# Altium schematic sheet Fan Control.SchDoc
size A3
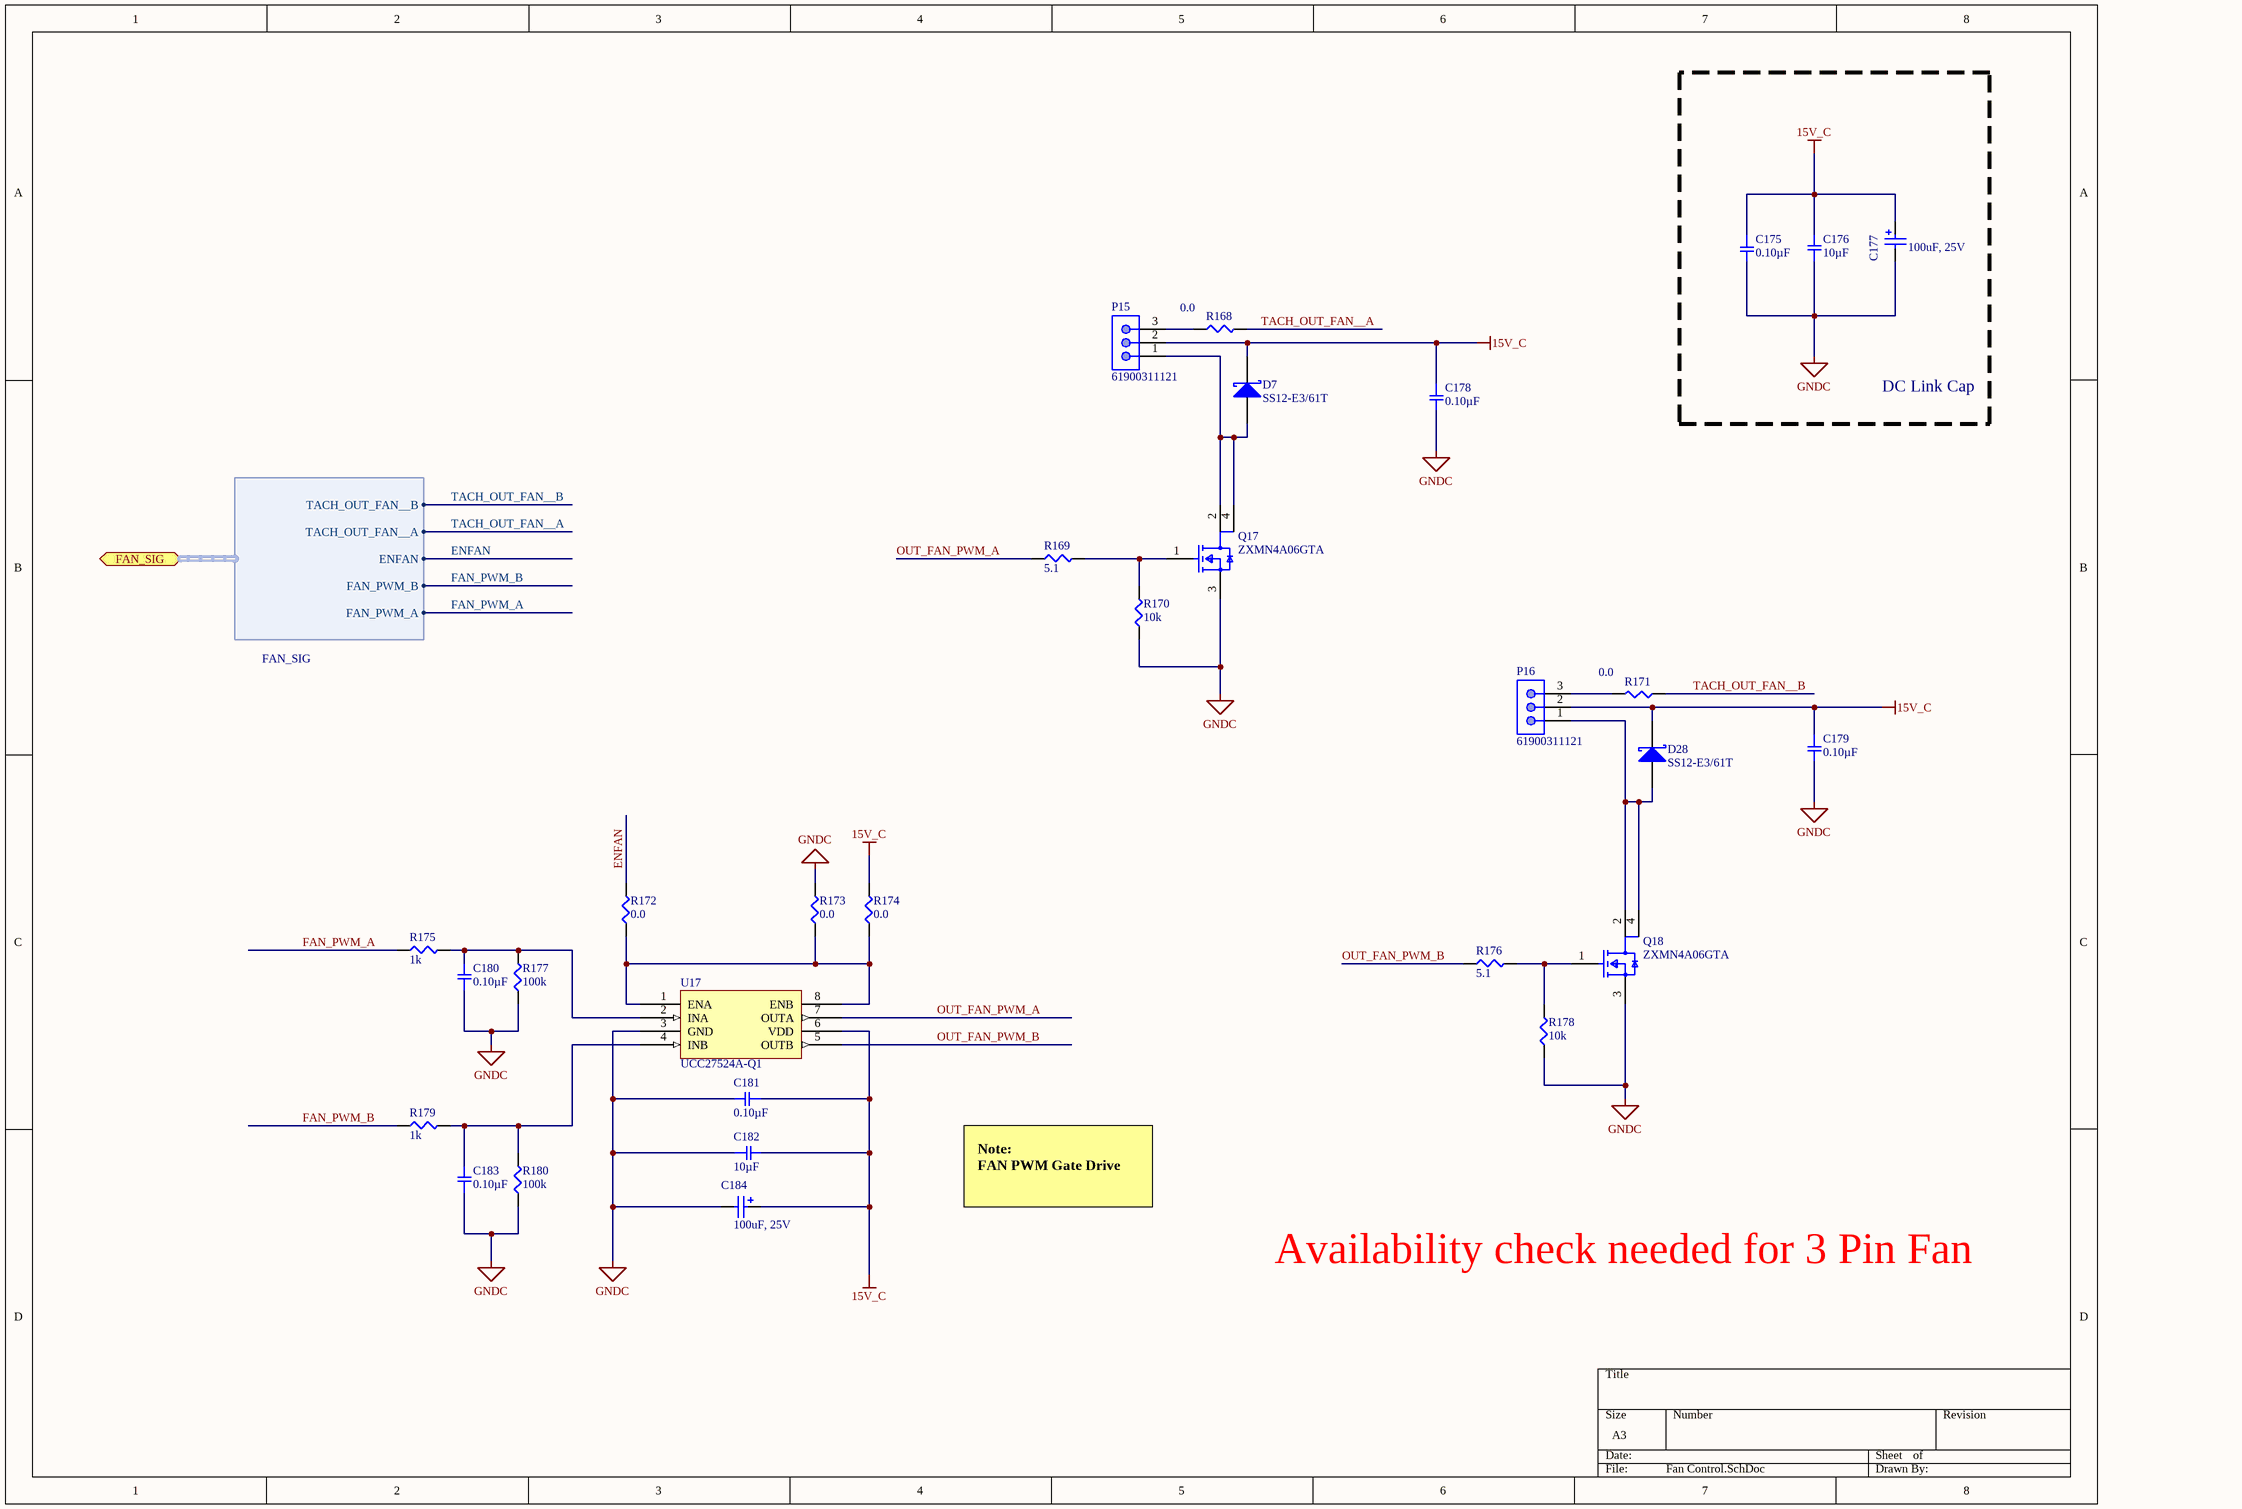
[diagram p0: Fan Control.SchDoc]

## Parts
C175  0.10µF  [SMD-0805C]
C176  10µF  [SMD-0805C]
C177  100uF, 25V  [WCAP-ASLL_6.3x7.7]
C178  0.10µF  [SMD-0805C]
C179  0.10µF  [SMD-0805C]
C180  0.10µF  [SMD-0805C]
C181  0.10µF  [SMD-0805C]
C182  10µF  [SMD-0805C]
C183  0.10µF  [SMD-0805C]
C184  100uF, 25V  [WCAP-ASLL_6.3x7.7]
D7  SS12-E3/61T  [VISH-DO-214AC_V]
D28  SS12-E3/61T  [VISH-DO-214AC_V]
P15  61900311121  [61900311121]
P16  61900311121  [61900311121]
Q17  ZXMN4A06GTA  [FP-SOT223-MFG]
Q18  ZXMN4A06GTA  [FP-SOT223-MFG]
R168  0.0  [SMD-0603-RES]
R169  5.1  [SMD-0805-RES]
R170  10k  [SMD-0805-RES]
R171  0.0  [SMD-0603-RES]
R172  0.0  [SMD-0603-RES]
R173  0.0  [SMD-0603-RES]
R174  0.0  [SMD-0603-RES]
R175  1k  [SMD-0603-RES]
R176  5.1  [SMD-0805-RES]
R177  100k  [SMD-0603-RES]
R178  10k  [SMD-0805-RES]
R179  1k  [SMD-0603-RES]
R180  100k  [SMD-0603-RES]
U17  UCC27524A-Q1  [SON65P300X75_HS-9N]

## Blocks framed on the sheet
DC Link Cap: C175-C177

## Ports
FAN_SIG (bidir, harness FAN_SIG)

## Harnesses
FAN_SIG: FAN_PWM_A, FAN_PWM_B, ENFAN, TACH_OUT_FAN__A, TACH_OUT_FAN__B

## Nets
15V_C: C175.1 C176.2 C177.2(P) C178.1 C179.1 C181.1 C182.2 C184.2(P) D7.2(K) D28.2(K) P15.2 P16.2 R174.2 U17.6(VDD)
GNDC: C175.2 C176.1 C177.1(N) C178.2 C179.2 C180.1 C181.2 C182.1 C183.1 C184.1(N) Q17.3(S) Q18.3(S) R170.1 R173.2 R177.1 R178.1 R180.1 U17.3(GND)
ENFAN: R172.2 ; port FAN_SIG.ENFAN
FAN_PWM_A: R175.1 ; port FAN_SIG.FAN_PWM_A
FAN_PWM_B: R179.1 ; port FAN_SIG.FAN_PWM_B
OUT_FAN_PWM_A: R169.1 U17.7(OUTA)
OUT_FAN_PWM_B: R176.1 U17.5(OUTB)
TACH_OUT_FAN__A: R168.2 ; port FAN_SIG.TACH_OUT_FAN__A
TACH_OUT_FAN__B: R171.1 ; port FAN_SIG.TACH_OUT_FAN__B
NetC180_2: C180.2 R175.2 R177.2 U17.2(INA)
NetC183_2: C183.2 R179.2 R180.2 U17.4(INB)
NetD7_1: D7.1(A) P15.1 Q17.2(D) Q17.4(D)
NetD28_1: D28.1(A) P16.1 Q18.2(D) Q18.4(D)
NetP15_3: P15.3 R168.1
NetP16_3: P16.3 R171.2
NetQ17_1: Q17.1(G) R169.2 R170.2
NetQ18_1: Q18.1(G) R176.2 R178.2
NetR172_1: R172.1 R173.1 R174.1 U17.1(ENA) U17.8(ENB)

## Notes on the sheet
- Note:
  FAN PWM Gate Drive
- Availability check needed for 3 Pin Fan

## Library data of the parts
C175 C178-C181 C183 = GCD21BR71H104KA01L: CAP CER 0.1UF 50V X7R 0805; Manufacturer: Murata Electronics North America; Factory Stock: 0; Unit Price (USD): 0.24; Minimum Quantity: 1; Tolerance: ±10%; Datasheets: http://www.murata.com/~/media/webrenewal/support/library/catalog/products/capacitor/mlcc/c03e.ashx; Image: //media.digikey.com/Renders/Murata%20Renders/0805%28GxM6%29.jpg; Digi-Key Part Number: 490-11955-1-ND; Part Number: GCD21BR71H104KA01L; Quantity Available: 157; @ qty: 0; Packaging: Cut Tape (CT); Series: GCD; Part Status: Active; Value: 0.10µF; Voltage: 50V; Temperature Coefficient: X7R; Operating Temperature: -55°C ~ 125°C; Features: -; Ratings: AEC-Q200; Applications: Automotive; Mounting Type: Surface Mount, MLCC; Package / Case: 0805 (2012 Metric); Size / Dimension: 0.079" L x 0.049" W (2.00mm x 1.25mm); Height - Seated (Max): -; Thickness (Max): 0.049" (1.25mm); Lead Spacing: -; Lead Style: -
C176 C182 = GRM21BC8YA106KE11L: CAP CER 10UF 35V X6S 0805; Manufacturer: Murata Electronics North America; Factory Stock: 0; Unit Price (USD): 0.33; Minimum Quantity: 1; Tolerance: ±10%; Datasheets: http://www.murata.com/~/media/webrenewal/support/library/catalog/products/capacitor/mlcc/c02e.pdf; Image: //media.digikey.com/Renders/Murata%20Renders/0805%20(2012%20Metric)%20.85mm.jpg; Digi-Key Part Number: 490-10504-1-ND; Part Number: GRM21BC8YA106KE11L; Quantity Available: 72253; @ qty: 0; Packaging: Cut Tape (CT); Series: GRM; Part Status: Active; Value: 10µF; Voltage: 35V; Temperature Coefficient: X6S; Operating Temperature: -55°C ~ 105°C; Features: Derating Recommended; Ratings: -; Applications: General Purpose; Mounting Type: Surface Mount, MLCC; Package / Case: 0805 (2012 Metric); Size / Dimension: 0.079" L x 0.049" W (2.00mm x 1.25mm); Height - Seated (Max): -; Thickness (Max): 0.057" (1.45mm); Lead Spacing: -; Lead Style: -
C177 C184 = 865060445005: WCAP-ASLL SMT Aluminum Electrolytic Capacitors, D6.3mm x L7.7mm, 100uF, +/-20%, 25VDC; Dissipation Factor: 14%; Endurance: 2000h; Leakage Current: 25uA; Ripple Current max.: 300mA; Technical Reference: ASED077101M025DVCTCB000; ComponentLink1Description: Manufacturer; ComponentLink1URL: http://www.we-online.de; ComponentLink2Description: Datasheet; ComponentLink2URL: https://katalog.we-online.com/pbs/datasheet/865060445005.pdf; Length: 7.7mm; Mounting Technology: SMT; Operating Temperature: -55 to +105degC; Packaging: Tape and Reel; Published Date: August 2019; Capacitance: 100uF; Diameter: 6.3mm; Part Number: 865060445005; Publisher: Wurth Elektronik; Capacitance Tolerance: +/-20%; Rated Voltage: 25VDC
D7 D28 = CMP-004-00017-1: Schottky Barrier Rectifier, 20 V, 1 A, -65 to 150 degC, 2-Pin DO-214AC (SMA), RoHS, Tape and Reel; Manufacturer: Vishay Semiconductor; Max Surge Current: 40A; Forward Voltage: 5dV; Forward Current: 1A; Peak Reverse Current: 6mA; Package Quantity: 1800; Datasheet URL: http://www.vishay.com/docs/88746/ss12.pdf; Case/Package: SMA; Package Description: 2-Pin Surface Mount Device, Body 4.245 x 2.665 mm; Pins: 2; Mounting Technology: SM; Min Operating Temperature: -65°C; Packaging: TapeandReel; Datasheet Version: Aug-15; Manufacturer URL: http://www.vishay.com/; RoHS Compliant: True; Package Reference: DO-214AC (SMA); Max Operating Temperature: 125°C
P15 P16 = 61900311121: WR-WTB THT Male Vertical Locking Header, pitch 2.54mm, 3p; Pin Number: 3; Contact Resistance: 20mOhm; Rated Current: 3A; Withstanding Voltage: 1000VAC; Working Voltage: 250VAC; ComponentLink1Description: Manufacturer; ComponentLink1URL: http://www.we-online.de; ComponentLink2Description: Datasheet; ComponentLink2URL: https://www.we-online.com/catalog/datasheet/61900311121.pdf; Pitch: 2.54mm; Published Date: January 2020; Publisher: Wurth Elektronik; Mounting Technology: THT; Packaging: Bag; Operating Temperature: -40 to +105degC; Part Number: 61900311121; Gender: Male; Type: Vertical
Q17 Q18 = CMP-12801-000020-1: MOSFET N-CH 40V 5A SOT223; Manufacturer: Diodes Inc.; Rthja Max: 62.5°C/W; Gate To Source Voltage: 20V; Number Of Channels: 1; Standoff Height: 0.01mm; Automotive Grade: Grade 0; Threshold Vgs Max: 2V; Drain To Source Resistance: 0.05Ω; Reverse Recovery Charge: 16.36nC; Reverse Recovery Time: 19.86ns; Input Capacitace At Vds: 770pF @ 40V; Max Forward Diode Voltage: 0.95V; Depletion Mode: False; Power Dissipation: 2W; Turn Off Delay Time: 28.61ns; Typ Forward Diode Voltage: 0.8V; Threshold Vgs Min: 1V; Pulse Drain Current: 22A; Gate Charge At Vgs: 18.2nC @ 10V; Transconductance: 8.7S; Max Junction Temp: +150°C; Turn On Delay Time: 2.55ns; Device Class L2: Transistors; Digikey Description: MOSFET N-CH 40V 5A SOT223; Ipc Land Pattern Name: SOT230P700X180-4; ComponentLink2Description: Datasheet; Manufacturer Part Number: ZXMN4A06GTA; Automotive: Yes; ComponentLink2URL: https://www.diodes.com/assets/Datasheets/ZXMN4A06G.pdf; Drain To Source Breakdown Voltage: 40V; Package: SOT223; Temperature Range High: +150°C; Height: 1.8mm; Octopart: https://octopart.com/zxmn4a06gta-diodes+inc.-660114; Mouser Description: MOSFET 40V N-Chnl UMOS; Lead Free: Yes; Number Of N Channels: 1; Device Class L1: Discrete Semiconductors; Drain To Source Voltage: 40V; RoHS: TRUE; Category: Trans; Temperature: -55°C to +150°C; Device Class L3: MOSFETs; Continuous Drain Current: 5A; Temperature Range Low: -55°C; Footprint Url: https://www.diodes.com/assets/Package-Files/SOT223.pdf
R168 R171-R174 = ERJ-3GEY0R00V: RES SMD 0.0OHM JUMPER 1/10W 0603; Manufacturer: Panasonic Electronic Components; Factory Stock: 0; Unit Price (USD): 0.00352; @ qty: 1500; Minimum Quantity: 1; Power (Watts): 0.1W, 1/10W; Part Number: ERJ-3GEY0R00V; Datasheets: http://industrial.panasonic.com/www-cgi/jvcr13pz.cgi?E+PZ+3+AOA0001+ERJ3GEY0R00V+7+WW; Image: //media.digikey.com/Photos/Panasonic%20Photos/MFG_ERJ-P6W%20Series.jpg; Digi-Key Part Number: P0.0GCT-ND; Quantity Available: 4813372; Packaging: Cut Tape (CT); Series: ERJ; Part Status: Active; Value: 0.0; Tolerance: Jumper; Composition: Thick Film; Features: Automotive AEC-Q200; Temperature Coefficient: -; Operating Temperature: -55°C ~ 155°C; Package / Case: 0603 (1608 Metric); Supplier Device Package: 0603; Size / Dimension: 0.063" L x 0.031" W (1.60mm x 0.80mm); Height - Seated (Max): 0.022" (0.55mm); Number of Terminations: 2; Failure Rate: -
R169 R176 = ERJ-6BQF5R1V: RES SMD 5.1 OHM 1% 1/3W 0805; Manufacturer: Panasonic Electronic Components; Factory Stock: 0; Unit Price (USD): 0.05834; @ qty: 1500; Minimum Quantity: 1; Power (Watts): 0.333W, 1/3W; Temperature Coefficient: ±200ppm/°C; Part Number: ERJ-6BQF5R1V; Datasheets: https://industrial.panasonic.com/cdbs/www-data/pdf/RDA0000/AOA0000C239.pdf; Image: //media.digikey.com/Renders/Panasonic%20Renders/ERJ-0805%20Pkg.jpg; Digi-Key Part Number: P17511CT-ND; Quantity Available: 3194; Packaging: Cut Tape (CT); Series: ERJ; Part Status: Active; Value: 5.1; Tolerance: ±1%; Composition: Thick Film; Features: Automotive AEC-Q200, Current Sense; Operating Temperature: -55°C ~ 125°C; Package / Case: 0805 (2012 Metric); Supplier Device Package: 0805; Size / Dimension: 0.079" L x 0.049" W (2.00mm x 1.25mm); Height - Seated (Max): 0.028" (0.70mm); Number of Terminations: 2; Failure Rate: -
R170 R178 = ERJ-6ENF1002V: RES SMD 10K OHM 1% 1/8W 0805; Manufacturer: Panasonic Electronic Components; Factory Stock: 0; Unit Price (USD): 0.00729; @ qty: 1500; Minimum Quantity: 1; Power (Watts): 0.125W, 1/8W; Temperature Coefficient: ±100ppm/°C; Part Number: ERJ-6ENF1002V; Datasheets: http://industrial.panasonic.com/www-cgi/jvcr13pz.cgi?E+PZ+3+AOA0002+ERJ6ENF1002V+7+WW; Image: //media.digikey.com/Renders/Panasonic%20Renders/ERJ-0805%20Pkg.jpg; Digi-Key Part Number: P10.0KCCT-ND; Quantity Available: 3985614; Packaging: Cut Tape (CT); Series: ERJ; Part Status: Active; Value: 10k; Tolerance: ±1%; Composition: Thick Film; Features: Automotive AEC-Q200; Operating Temperature: -55°C ~ 155°C; Package / Case: 0805 (2012 Metric); Supplier Device Package: 0805; Size / Dimension: 0.079" L x 0.049" W (2.00mm x 1.25mm); Height - Seated (Max): 0.028" (0.70mm); Number of Terminations: 2; Failure Rate: -
R175 R179 = ERJ-3EKF1001V: RES SMD 1K OHM 1% 1/10W 0603; Manufacturer: Panasonic Electronic Components; Factory Stock: 0; Unit Price (USD): 0.00379; @ qty: 1500; Minimum Quantity: 1; Power (Watts): 0.1W, 1/10W; Temperature Coefficient: ±100ppm/°C; Part Number: ERJ-3EKF1001V; Datasheets: http://industrial.panasonic.com/www-cgi/jvcr13pz.cgi?E+PZ+3+AOA0002+ERJ3EKF1001V+7+WW; Image: //media.digikey.com/Photos/Panasonic%20Photos/MFG_ERJ-P6W%20Series.jpg; Digi-Key Part Number: P1.00KHCT-ND; Quantity Available: 5218845; Packaging: Cut Tape (CT); Series: ERJ; Part Status: Active; Value: 1k; Tolerance: ±1%; Composition: Thick Film; Features: Automotive AEC-Q200; Operating Temperature: -55°C ~ 155°C; Package / Case: 0603 (1608 Metric); Supplier Device Package: 0603; Size / Dimension: 0.063" L x 0.031" W (1.60mm x 0.80mm); Height - Seated (Max): 0.022" (0.55mm); Number of Terminations: 2; Failure Rate: -
R177 R180 = ERJ-3EKF1003V: RES SMD 100K OHM 1% 1/10W 0603; Manufacturer: Panasonic Electronic Components; Factory Stock: 0; Unit Price (USD): 0.00379; @ qty: 1500; Minimum Quantity: 1; Power (Watts): 0.1W, 1/10W; Temperature Coefficient: ±100ppm/°C; Part Number: ERJ-3EKF1003V; Datasheets: http://industrial.panasonic.com/www-cgi/jvcr13pz.cgi?E+PZ+3+AOA0002+ERJ3EKF1003V+7+WW; Image: //media.digikey.com/Photos/Panasonic%20Photos/MFG_ERJ-P6W%20Series.jpg; Digi-Key Part Number: P100KHCT-ND; Quantity Available: 2179804; Packaging: Cut Tape (CT); Series: ERJ; Part Status: Active; Value: 100k; Tolerance: ±1%; Composition: Thick Film; Features: Automotive AEC-Q200; Operating Temperature: -55°C ~ 155°C; Package / Case: 0603 (1608 Metric); Supplier Device Package: 0603; Size / Dimension: 0.063" L x 0.031" W (1.60mm x 0.80mm); Height - Seated (Max): 0.022" (0.55mm); Number of Terminations: 2; Failure Rate: -
U17 = UCC27524A